# Altium project ZYNQ-7000 SOM Bd.PrjPcb (part 2 of 2)

## Sheet 09_Connectors.SchDoc
size A3; SheetNumber: 9; SheetTotal: 9
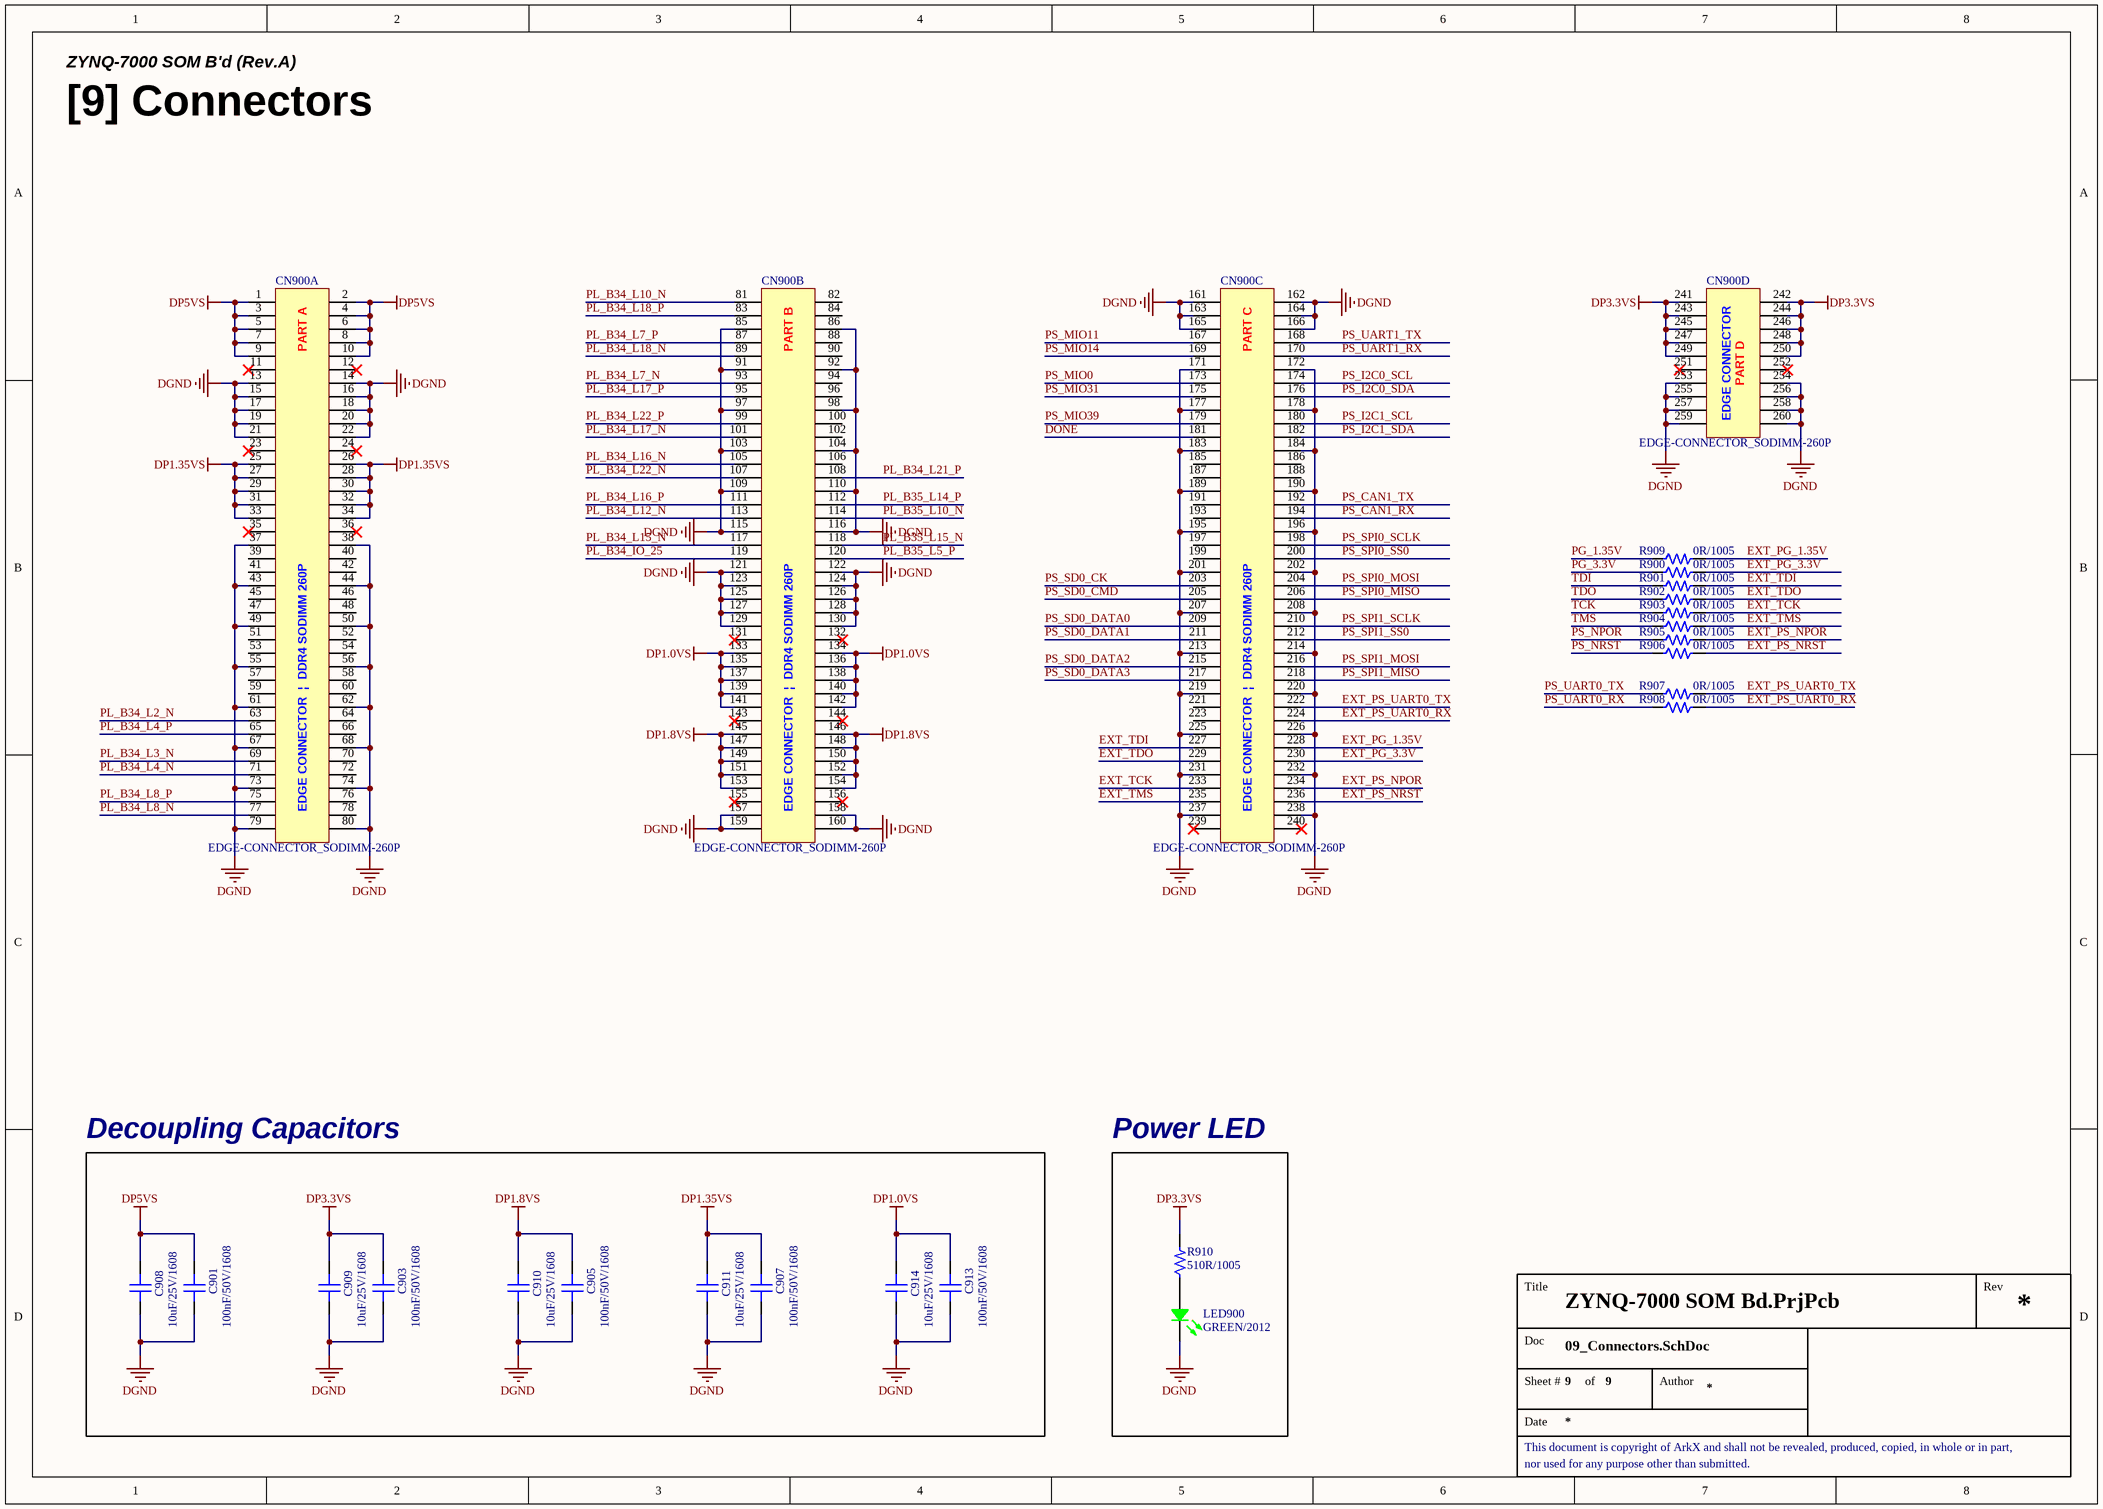
[diagram p8: 09_Connectors.SchDoc]

### Parts
C901  100nF/50V/1608  [CAP 1608 (0603_INCH)]
C903  100nF/50V/1608  [CAP 1608 (0603_INCH)]
C905  100nF/50V/1608  [CAP 1608 (0603_INCH)]
C907  100nF/50V/1608  [CAP 1608 (0603_INCH)]
C908  10uF/25V/1608  [CAP 1608 (0603_INCH)]
C909  10uF/25V/1608  [CAP 1608 (0603_INCH)]
C910  10uF/25V/1608  [CAP 1608 (0603_INCH)]
C911  10uF/25V/1608  [CAP 1608 (0603_INCH)]
C913  100nF/50V/1608  [CAP 1608 (0603_INCH)]
C914  10uF/25V/1608  [CAP 1608 (0603_INCH)]
CN900  EDGE-CONNECTOR_SODIMM-260P  [CON_EDGE-CONNECTOR_DDR4-SODIMM-260P]  (parts A,B,C,D of 4)
LED900  GREEN/2012  [LED MHT170RGBCT (GREEN)]
R900  0R/1005  [RES 1005 (0402_inch)]
R901  0R/1005  [RES 1005 (0402_inch)]
R902  0R/1005  [RES 1005 (0402_inch)]
R903  0R/1005  [RES 1005 (0402_inch)]
R904  0R/1005  [RES 1005 (0402_inch)]
R905  0R/1005  [RES 1005 (0402_inch)]
R906  0R/1005  [RES 1005 (0402_inch)]
R907  0R/1005  [RES 1005 (0402_inch)]
R908  0R/1005  [RES 1005 (0402_inch)]
R909  0R/1005  [RES 1005 (0402_inch)]
R910  510R/1005  [RES 1005 (0402_inch)]

### Blocks framed on the sheet
Decoupling Capacitors: C901 C903 C905 C907-C911 C913 C914
Power LED: LED900 R910

### Nets
DGND: C901.1 C903.1 C905.1 C907.1 C908.1 C909.1 C910.1 C911.1 C913.1 C914.1 CN900.13 CN900.14 CN900.15 CN900.16 CN900.17 CN900.18 CN900.19 CN900.20 CN900.21 CN900.22 CN900.37 CN900.38 CN900.43 CN900.44 CN900.49 CN900.50 CN900.55 CN900.56 CN900.61 CN900.62 CN900.67 CN900.68 CN900.73 CN900.74 CN900.79 CN900.80 CN900.85 CN900.86 CN900.91 CN900.92 CN900.97 CN900.98 CN900.103 CN900.104 CN900.109 CN900.110 CN900.115 CN900.116 CN900.121 CN900.122 CN900.123 CN900.124 CN900.125 CN900.126 CN900.127 CN900.128 CN900.129 CN900.130 CN900.157 CN900.158 CN900.159 CN900.160 CN900.161 CN900.162 CN900.163 CN900.164 CN900.165 CN900.166 CN900.171 CN900.172 CN900.177 CN900.178 CN900.183 CN900.184 CN900.189 CN900.190 CN900.195 CN900.196 CN900.201 CN900.202 CN900.207 CN900.208 CN900.213 CN900.214 CN900.219 CN900.220 CN900.225 CN900.226 CN900.231 CN900.232 CN900.237 CN900.238 CN900.253 CN900.254 CN900.255 CN900.256 CN900.257 CN900.258 CN900.259 CN900.260 LED900.2(GREEN)
DP1.0VS: C913.2 C914.2 CN900.133 CN900.134 CN900.135 CN900.136 CN900.137 CN900.138 CN900.139 CN900.140 CN900.141 CN900.142
DP1.8VS: C905.2 C910.2 CN900.145 CN900.146 CN900.147 CN900.148 CN900.149 CN900.150 CN900.151 CN900.152 CN900.153 CN900.154
DP1.35VS: C907.2 C911.2 CN900.25 CN900.26 CN900.27 CN900.28 CN900.29 CN900.30 CN900.31 CN900.32 CN900.33 CN900.34
DP3.3VS: C903.2 C909.2 CN900.241 CN900.242 CN900.243 CN900.244 CN900.245 CN900.246 CN900.247 CN900.248 CN900.249 CN900.250 R910.2
DP5VS: C901.2 C908.2 CN900.1 CN900.2 CN900.3 CN900.4 CN900.5 CN900.6 CN900.7 CN900.8 CN900.9 CN900.10
DONE: CN900.181
EXT_PG_1.35V: CN900.228 R909.2
EXT_PG_3.3V: CN900.230 R900.2
EXT_PS_NPOR: CN900.234 R905.2
EXT_PS_NRST: CN900.236 R906.2
EXT_PS_UART0_RX: CN900.224 R908.2
EXT_PS_UART0_TX: CN900.222 R907.2
EXT_TCK: CN900.233 R903.2
EXT_TDI: CN900.227 R901.2
EXT_TDO: CN900.229 R902.2
EXT_TMS: CN900.235 R904.2
PG_1.35V: R909.1
PG_3.3V: R900.1
PL_B34_IO_25: CN900.119
PL_B34_L2_N: CN900.63
PL_B34_L3_N: CN900.69
PL_B34_L4_N: CN900.71
PL_B34_L4_P: CN900.65
PL_B34_L7_N: CN900.93
PL_B34_L7_P: CN900.87
PL_B34_L8_N: CN900.77
PL_B34_L8_P: CN900.75
PL_B34_L10_N: CN900.81
PL_B34_L12_N: CN900.113
PL_B34_L15_N: CN900.117
PL_B34_L16_N: CN900.105
PL_B34_L16_P: CN900.111
PL_B34_L17_N: CN900.101
PL_B34_L17_P: CN900.95
PL_B34_L18_N: CN900.89
PL_B34_L18_P: CN900.83
PL_B34_L21_P: CN900.108
PL_B34_L22_N: CN900.107
PL_B34_L22_P: CN900.99
PL_B35_L5_P: CN900.120
PL_B35_L10_N: CN900.114
PL_B35_L14_P: CN900.112
PL_B35_L15_N: CN900.118
PS_CAN1_RX: CN900.194
PS_CAN1_TX: CN900.192
PS_I2C0_SCL: CN900.174
PS_I2C0_SDA: CN900.176
PS_I2C1_SCL: CN900.180
PS_I2C1_SDA: CN900.182
PS_MIO0: CN900.173
PS_MIO11: CN900.167
PS_MIO14: CN900.169
PS_MIO31: CN900.175
PS_MIO39: CN900.179
PS_NPOR: R905.1
PS_NRST: R906.1
PS_SD0_CK: CN900.203
PS_SD0_CMD: CN900.205
PS_SD0_DATA0: CN900.209
PS_SD0_DATA1: CN900.211
PS_SD0_DATA2: CN900.215
PS_SD0_DATA3: CN900.217
PS_SPI0_MISO: CN900.206
PS_SPI0_MOSI: CN900.204
PS_SPI0_SCLK: CN900.198
PS_SPI0_SS0: CN900.200
PS_SPI1_MISO: CN900.218
PS_SPI1_MOSI: CN900.216
PS_SPI1_SCLK: CN900.210
PS_SPI1_SS0: CN900.212
PS_UART0_RX: R908.1
PS_UART0_TX: R907.1
PS_UART1_RX: CN900.170
PS_UART1_TX: CN900.168
TCK: R903.1
TDI: R901.1
TDO: R902.1
TMS: R904.1
NetLED900_4: LED900.4(Common_Anode) R910.1

Not connected (* = marked no-connect by the designer): CN900 11* 12* 23* 24* 35* 36* 39 40 41 42 45 46 47 48 51 52 53 54 57 58 59 60 64 66 70 72 76 78 82 84 88 90 94 96 100 102 106 131* 132* 143* 144* 155* 156* 185 186 187 188 191 193 197 199 221 223 239* 240* 251* 252*

### Notes on the sheet
- ZYNQ-7000 SOM B'd (Rev.A)
- [9] Connectors
- Title
- Rev
- Doc
- Sheet #
- of
- Author
- This document is copyright of ArkX and shall not be revealed, produced, copied, in whole or in part,
- Date
- nor used for any purpose other than submitted.
- (in symbol CON_EDGE-CONNECTOR_DDR4-SODIMM-260P, part A) PART A; EDGE CONNECTOR  |  DDR4 SODIMM 260P
- (in symbol CON_EDGE-CONNECTOR_DDR4-SODIMM-260P, part B) PART B; EDGE CONNECTOR  |  DDR4 SODIMM 260P
- (in symbol CON_EDGE-CONNECTOR_DDR4-SODIMM-260P, part C) PART C; EDGE CONNECTOR  |  DDR4 SODIMM 260P
- (in symbol CON_EDGE-CONNECTOR_DDR4-SODIMM-260P, part D) EDGE CONNECTOR; PART D

### Library data of the parts
C901 C903 C905 C907 C913 = CAP_100nF/50V/1608: Ceramic CAP_100nF/50V/1608; LCSC Part #: C14663; JLCPCB Part Type: Basic Part
C908-C911 C914 = CAP_10uF/25V/1608: Ceramic CAP_10uF/25V/1608; LCSC Part #: C96446; JLCPCB Part Type: Basic Part
CN900 = CON_EDGE-CONNECTOR_DDR4-SODIMM-260P: EDGE-CONNECTOR_DDR4-SODIMM-260P; Mating Part Number: 2309409-1
LED900 = LED_MHT170RGBCT(GREEN): Colorless transparence -30℃~+85℃ Positive post Common anode RGB 120° 0805  Light Emitting Diodes (LED) ROHS; LCSC Part #: C2962094; JLCPCB Part Type: Extended Part
R900-R909 = RES_0R/1005/62.5mW: Value: 0R; Power Rating: 62.5mW; Precision: 1%; Size: 1005; LCSC Part #: C17168; JLCPCB Part Type: Basic Part
R910 = RES_510R/1005/62.5mW: Value: 510R; Power Rating: 62.5mW; Precision: 1%; Size: 1005; LCSC Part #: C25123; JLCPCB Part Type: Basic Part

## Nets that join several sheets
DGND: 03_ZYNQ_Power (110 pins), 04_ZYNQ_Config (27 pins), 05_ZYNQ_PS (13 pins), 06_ZYNQ_PL (C600.2 C601.1 X600.2), 07_ZYNQ_DDR (24 pins), 08_DDR3L_Modules (90 pins), 09_Connectors (101 pins)
DP0.675VS_REF: 07_ZYNQ_DDR (6 pins), 08_DDR3L_Modules (8 pins)
DP1.0VS: 03_ZYNQ_Power (29 pins), 09_Connectors (12 pins)
DP1.8VS: 03_ZYNQ_Power (22 pins), 09_Connectors (12 pins)
DP1.35VS: 03_ZYNQ_Power (16 pins), 07_ZYNQ_DDR (R727.2 R728.1), 08_DDR3L_Modules (82 pins), 09_Connectors (12 pins)
DP3.3VS: 03_ZYNQ_Power (47 pins), 04_ZYNQ_Config (15 pins), 05_ZYNQ_PS (14 pins), 06_ZYNQ_PL (6 pins), 09_Connectors (13 pins)
DP5VS: 07_ZYNQ_DDR (C714.2 C719.1 U701.6 U701.7), 09_Connectors (12 pins)
DDR_A0: 07_ZYNQ_DDR (R709.1 U300.N2), 08_DDR3L_Modules (U800.N3 U801.N3)
DDR_A1: 07_ZYNQ_DDR (R710.1 U300.K2), 08_DDR3L_Modules (U800.P7 U801.P7)
DDR_A2: 07_ZYNQ_DDR (R711.1 U300.M3), 08_DDR3L_Modules (U800.P3 U801.P3)
DDR_A3: 07_ZYNQ_DDR (R712.1 U300.K3), 08_DDR3L_Modules (U800.N2 U801.N2)
DDR_A4: 07_ZYNQ_DDR (R713.1 U300.M4), 08_DDR3L_Modules (U800.P8 U801.P8)
DDR_A5: 07_ZYNQ_DDR (R714.1 U300.L1), 08_DDR3L_Modules (U800.P2 U801.P2)
DDR_A6: 07_ZYNQ_DDR (R715.1 U300.L4), 08_DDR3L_Modules (U800.R8 U801.R8)
DDR_A7: 07_ZYNQ_DDR (R716.1 U300.K4), 08_DDR3L_Modules (U800.R2 U801.R2)
DDR_A8: 07_ZYNQ_DDR (R717.1 U300.K1), 08_DDR3L_Modules (U800.T8 U801.T8)
DDR_A9: 07_ZYNQ_DDR (R718.1 U300.J4), 08_DDR3L_Modules (U800.R3 U801.R3)
DDR_A10: 07_ZYNQ_DDR (R719.1 U300.F5), 08_DDR3L_Modules (U800.L7 U801.L7)
DDR_A11: 07_ZYNQ_DDR (R720.1 U300.G4), 08_DDR3L_Modules (U800.R7 U801.R7)
DDR_A12: 07_ZYNQ_DDR (R721.1 U300.E4), 08_DDR3L_Modules (U800.N7 U801.N7)
DDR_A13: 07_ZYNQ_DDR (R722.1 U300.D4), 08_DDR3L_Modules (U800.T3 U801.T3)
DDR_A14: 07_ZYNQ_DDR (R723.1 U300.F4), 08_DDR3L_Modules (U800.T7 U801.T7)
DDR_BA0: 07_ZYNQ_DDR (R706.1 U300.L5), 08_DDR3L_Modules (U800.M2 U801.M2)
DDR_BA1: 07_ZYNQ_DDR (R707.1 U300.R4), 08_DDR3L_Modules (U800.N8 U801.N8)
DDR_BA2: 07_ZYNQ_DDR (R708.1 U300.J5), 08_DDR3L_Modules (U800.M3 U801.M3)
DDR_CK_N: 07_ZYNQ_DDR (R700.1 U300.M2), 08_DDR3L_Modules (U800.K7 U801.K7)
DDR_CK_P: 07_ZYNQ_DDR (R700.2 U300.L2), 08_DDR3L_Modules (U800.J7 U801.J7)
DDR_CKE: 07_ZYNQ_DDR (R701.1 U300.N3), 08_DDR3L_Modules (U800.K9 U801.K9)
DDR_DM0: 07_ZYNQ_DDR (U300.A1), 08_DDR3L_Modules (U800.D3)
DDR_DM1: 07_ZYNQ_DDR (U300.F1), 08_DDR3L_Modules (U800.E7)
DDR_DM2: 07_ZYNQ_DDR (U300.T1), 08_DDR3L_Modules (U801.E7)
DDR_DM3: 07_ZYNQ_DDR (U300.Y1), 08_DDR3L_Modules (U801.D3)
DDR_DQ0: 07_ZYNQ_DDR (U300.C3), 08_DDR3L_Modules (U800.C3)
DDR_DQ1: 07_ZYNQ_DDR (U300.B3), 08_DDR3L_Modules (U800.A3)
DDR_DQ2: 07_ZYNQ_DDR (U300.A2), 08_DDR3L_Modules (U800.C2)
DDR_DQ3: 07_ZYNQ_DDR (U300.A4), 08_DDR3L_Modules (U800.A2)
DDR_DQ4: 07_ZYNQ_DDR (U300.D3), 08_DDR3L_Modules (U800.C8)
DDR_DQ5: 07_ZYNQ_DDR (U300.D1), 08_DDR3L_Modules (U800.B8)
DDR_DQ6: 07_ZYNQ_DDR (U300.C1), 08_DDR3L_Modules (U800.A7)
DDR_DQ7: 07_ZYNQ_DDR (U300.E1), 08_DDR3L_Modules (U800.D7)
DDR_DQ8: 07_ZYNQ_DDR (U300.E2), 08_DDR3L_Modules (U800.F2)
DDR_DQ9: 07_ZYNQ_DDR (U300.E3), 08_DDR3L_Modules (U800.G2)
DDR_DQ10: 07_ZYNQ_DDR (U300.G3), 08_DDR3L_Modules (U800.E3)
DDR_DQ11: 07_ZYNQ_DDR (U300.H3), 08_DDR3L_Modules (U800.H3)
DDR_DQ12: 07_ZYNQ_DDR (U300.J3), 08_DDR3L_Modules (U800.F7)
DDR_DQ13: 07_ZYNQ_DDR (U300.H2), 08_DDR3L_Modules (U800.H7)
DDR_DQ14: 07_ZYNQ_DDR (U300.H1), 08_DDR3L_Modules (U800.H8)
DDR_DQ15: 07_ZYNQ_DDR (U300.J1), 08_DDR3L_Modules (U800.F8)
DDR_DQ16: 07_ZYNQ_DDR (U300.P1), 08_DDR3L_Modules (U801.G2)
DDR_DQ17: 07_ZYNQ_DDR (U300.P3), 08_DDR3L_Modules (U801.F2)
DDR_DQ18: 07_ZYNQ_DDR (U300.R3), 08_DDR3L_Modules (U801.H3)
DDR_DQ19: 07_ZYNQ_DDR (U300.R1), 08_DDR3L_Modules (U801.E3)
DDR_DQ20: 07_ZYNQ_DDR (U300.T4), 08_DDR3L_Modules (U801.F8)
DDR_DQ21: 07_ZYNQ_DDR (U300.U4), 08_DDR3L_Modules (U801.H8)
DDR_DQ22: 07_ZYNQ_DDR (U300.U2), 08_DDR3L_Modules (U801.H7)
DDR_DQ23: 07_ZYNQ_DDR (U300.U3), 08_DDR3L_Modules (U801.F7)
DDR_DQ24: 07_ZYNQ_DDR (U300.V1), 08_DDR3L_Modules (U801.A2)
DDR_DQ25: 07_ZYNQ_DDR (U300.Y3), 08_DDR3L_Modules (U801.C8)
DDR_DQ26: 07_ZYNQ_DDR (U300.W1), 08_DDR3L_Modules (U801.C2)
DDR_DQ27: 07_ZYNQ_DDR (U300.Y4), 08_DDR3L_Modules (U801.A7)
DDR_DQ28: 07_ZYNQ_DDR (U300.Y2), 08_DDR3L_Modules (U801.D7)
DDR_DQ29: 07_ZYNQ_DDR (U300.W3), 08_DDR3L_Modules (U801.C3)
DDR_DQ30: 07_ZYNQ_DDR (U300.V2), 08_DDR3L_Modules (U801.A3)
DDR_DQ31: 07_ZYNQ_DDR (U300.V3), 08_DDR3L_Modules (U801.B8)
DDR_DQS0_N: 07_ZYNQ_DDR (U300.B2), 08_DDR3L_Modules (U800.B7)
DDR_DQS0_P: 07_ZYNQ_DDR (U300.C2), 08_DDR3L_Modules (U800.C7)
DDR_DQS1_N: 07_ZYNQ_DDR (U300.F2), 08_DDR3L_Modules (U800.G3)
DDR_DQS1_P: 07_ZYNQ_DDR (U300.G2), 08_DDR3L_Modules (U800.F3)
DDR_DQS2_N: 07_ZYNQ_DDR (U300.T2), 08_DDR3L_Modules (U801.G3)
DDR_DQS2_P: 07_ZYNQ_DDR (U300.R2), 08_DDR3L_Modules (U801.F3)
DDR_DQS3_N: 07_ZYNQ_DDR (U300.W4), 08_DDR3L_Modules (U801.B7)
DDR_DQS3_P: 07_ZYNQ_DDR (U300.W5), 08_DDR3L_Modules (U801.C7)
DDR_NCAS: 07_ZYNQ_DDR (R704.1 U300.P5), 08_DDR3L_Modules (U800.K3 U801.K3)
DDR_NCS: 07_ZYNQ_DDR (R702.1 U300.N1), 08_DDR3L_Modules (U800.L2 U801.L2)
DDR_NRAS: 07_ZYNQ_DDR (R703.1 U300.P4), 08_DDR3L_Modules (U800.J3 U801.J3)
DDR_NRST: 07_ZYNQ_DDR (R726.2 U300.B4), 08_DDR3L_Modules (U800.T2 U801.T2)
DDR_NWE: 07_ZYNQ_DDR (R705.1 U300.M5), 08_DDR3L_Modules (U800.L3 U801.L3)
DDR_ODT: 07_ZYNQ_DDR (R724.1 U300.N5), 08_DDR3L_Modules (U800.K1 U801.K1)
DONE: 04_ZYNQ_Config (Q400.1 R402.1 U300.R11), 09_Connectors (CN900.181)
FLASH_CLK_BM4: 04_ZYNQ_Config (R414.1), 05_ZYNQ_PS (R502.2 U500.6)
PG_1.35V: 07_ZYNQ_DDR (R725.2), 09_Connectors (R909.1)
PG_3.3V: 05_ZYNQ_PS (U502.2), 09_Connectors (R900.1)
PL_B34_IO_25: 06_ZYNQ_PL (U300.T19), 09_Connectors (CN900.119)
PL_B34_L2_N: 06_ZYNQ_PL (U300.U12), 09_Connectors (CN900.63)
PL_B34_L3_N: 06_ZYNQ_PL (U300.V13), 09_Connectors (CN900.69)
PL_B34_L4_N: 06_ZYNQ_PL (U300.W13), 09_Connectors (CN900.71)
PL_B34_L4_P: 06_ZYNQ_PL (U300.V12), 09_Connectors (CN900.65)
PL_B34_L7_N: 06_ZYNQ_PL (U300.Y17), 09_Connectors (CN900.93)
PL_B34_L7_P: 06_ZYNQ_PL (U300.Y16), 09_Connectors (CN900.87)
PL_B34_L8_N: 06_ZYNQ_PL (U300.Y14), 09_Connectors (CN900.77)
PL_B34_L8_P: 06_ZYNQ_PL (U300.W14), 09_Connectors (CN900.75)
PL_B34_L10_N: 06_ZYNQ_PL (U300.W15), 09_Connectors (CN900.81)
PL_B34_L12_N: 06_ZYNQ_PL (U300.U19), 09_Connectors (CN900.113)
PL_B34_L15_N: 06_ZYNQ_PL (U300.U20), 09_Connectors (CN900.117)
PL_B34_L16_N: 06_ZYNQ_PL (U300.W20), 09_Connectors (CN900.105)
PL_B34_L16_P: 06_ZYNQ_PL (U300.V20), 09_Connectors (CN900.111)
PL_B34_L17_N: 06_ZYNQ_PL (U300.Y19), 09_Connectors (CN900.101)
PL_B34_L17_P: 06_ZYNQ_PL (U300.Y18), 09_Connectors (CN900.95)
PL_B34_L18_N: 06_ZYNQ_PL (U300.W16), 09_Connectors (CN900.89)
PL_B34_L18_P: 06_ZYNQ_PL (U300.V16), 09_Connectors (CN900.83)
PL_B34_L21_P: 06_ZYNQ_PL (U300.V17), 09_Connectors (CN900.108)
PL_B34_L22_N: 06_ZYNQ_PL (U300.W19), 09_Connectors (CN900.107)
PL_B34_L22_P: 06_ZYNQ_PL (U300.W18), 09_Connectors (CN900.99)
PL_B35_L5_P: 06_ZYNQ_PL (U300.E18), 09_Connectors (CN900.120)
PL_B35_L10_N: 06_ZYNQ_PL (U300.J19), 09_Connectors (CN900.114)
PL_B35_L14_P: 06_ZYNQ_PL (U300.J18), 09_Connectors (CN900.112)
PL_B35_L15_N: 06_ZYNQ_PL (U300.F20), 09_Connectors (CN900.118)
PS_CAN1_RX: 05_ZYNQ_PS (R503.1 U300.F14), 09_Connectors (CN900.194)
PS_CAN1_TX: 05_ZYNQ_PS (R503.2 U300.A17), 09_Connectors (CN900.192)
PS_I2C0_SCL: 05_ZYNQ_PS (U300.B17), 09_Connectors (CN900.174)
PS_I2C0_SDA: 05_ZYNQ_PS (U300.D11), 09_Connectors (CN900.176)
PS_I2C1_SCL: 05_ZYNQ_PS (U300.A19), 09_Connectors (CN900.180)
PS_I2C1_SDA: 05_ZYNQ_PS (U300.E14), 09_Connectors (CN900.182)
PS_MIO0: 05_ZYNQ_PS (U300.E6), 09_Connectors (CN900.173)
PS_MIO11: 05_ZYNQ_PS (U300.C6), 09_Connectors (CN900.167)
PS_MIO14: 05_ZYNQ_PS (U300.C5), 09_Connectors (CN900.169)
PS_MIO31: 05_ZYNQ_PS (U300.E16), 09_Connectors (CN900.175)
PS_MIO39: 05_ZYNQ_PS (U300.C18), 09_Connectors (CN900.179)
PS_NPOR: 05_ZYNQ_PS (C504.1 R505.1 U300.C7 U502.4), 09_Connectors (R905.1)
PS_NRST: 04_ZYNQ_Config (CN400.14), 05_ZYNQ_PS (C503.1 R504.1 SW500.1 U300.B10), 09_Connectors (R906.1)
PS_QSPI_DQ0_BM3: 04_ZYNQ_Config (R413.1), 05_ZYNQ_PS (U300.B8 U500.5)
PS_QSPI_DQ1_BM1: 04_ZYNQ_Config (R415.1), 05_ZYNQ_PS (U300.D6 U500.2)
PS_QSPI_DQ2_BM2: 04_ZYNQ_Config (R416.1), 05_ZYNQ_PS (U300.B7 U500.3)
PS_QSPI_DQ3_BM0: 04_ZYNQ_Config (R412.1), 05_ZYNQ_PS (U300.A6 U500.7)
PS_SD0_CK: 05_ZYNQ_PS (U300.D14), 09_Connectors (CN900.203)
PS_SD0_CMD: 05_ZYNQ_PS (U300.C17), 09_Connectors (CN900.205)
PS_SD0_DATA0: 05_ZYNQ_PS (U300.E12), 09_Connectors (CN900.209)
PS_SD0_DATA1: 05_ZYNQ_PS (U300.A9), 09_Connectors (CN900.211)
PS_SD0_DATA2: 05_ZYNQ_PS (U300.F13), 09_Connectors (CN900.215)
PS_SD0_DATA3: 05_ZYNQ_PS (U300.B15), 09_Connectors (CN900.217)
PS_SPI0_MISO: 05_ZYNQ_PS (U300.C13), 09_Connectors (CN900.206)
PS_SPI0_MOSI: 05_ZYNQ_PS (U300.D15), 09_Connectors (CN900.204)
PS_SPI0_SCLK: 05_ZYNQ_PS (U300.C16), 09_Connectors (CN900.198)
PS_SPI0_SS0: 05_ZYNQ_PS (U300.C15), 09_Connectors (CN900.200)
PS_SPI1_MISO: 05_ZYNQ_PS (U300.B14), 09_Connectors (CN900.218)
PS_SPI1_MOSI: 05_ZYNQ_PS (U300.D16), 09_Connectors (CN900.216)
PS_SPI1_SCLK: 05_ZYNQ_PS (U300.B12), 09_Connectors (CN900.210)
PS_SPI1_SS0: 05_ZYNQ_PS (U300.C12), 09_Connectors (CN900.212)
PS_UART0_RX: 05_ZYNQ_PS (U300.A12), 09_Connectors (R908.1)
PS_UART0_TX: 05_ZYNQ_PS (U300.F12), 09_Connectors (R907.1)
PS_UART1_RX: 05_ZYNQ_PS (U300.F15), 09_Connectors (CN900.170)
PS_UART1_TX: 05_ZYNQ_PS (U300.A16), 09_Connectors (CN900.168)
PS_USER_DIP_SW: 04_ZYNQ_Config (C401.2 R422.2 SW401.4), 05_ZYNQ_PS (U300.C8)
TCK: 04_ZYNQ_Config (R407.1 U300.F9), 09_Connectors (R903.1)
TDI: 04_ZYNQ_Config (R400.1 R405.1 U300.G6), 09_Connectors (R901.1)
TDO: 04_ZYNQ_Config (R406.1 U300.F6), 09_Connectors (R902.1)
TMS: 04_ZYNQ_Config (R401.1 R408.1 U300.J6), 09_Connectors (R904.1)